# Altium schematic sheet STM32H755_Breakout_Schematic.SchDoc
size A; SheetNumber: 1; SheetTotal: 3
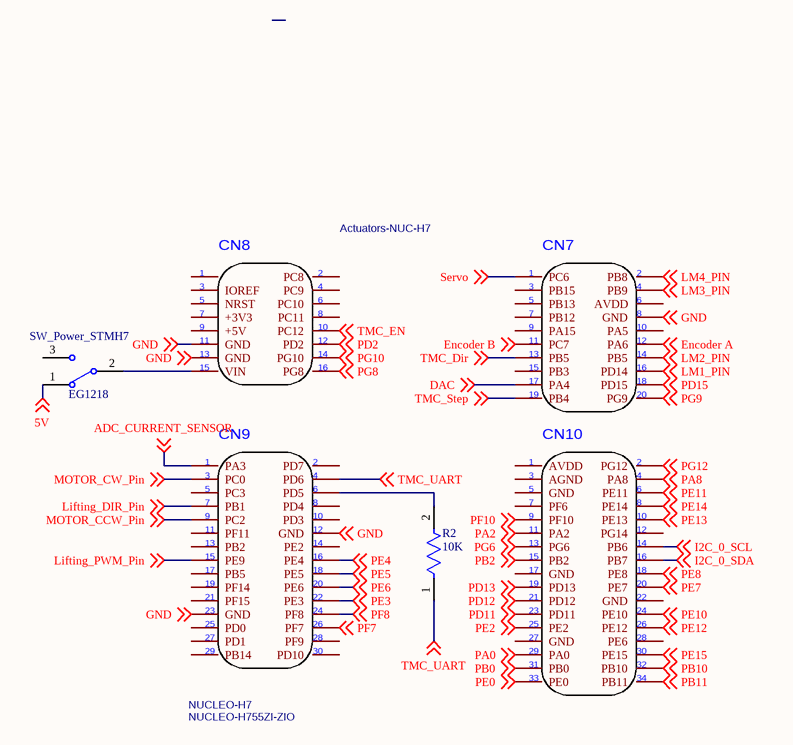
[diagram p0: STM32H755_Breakout_Schematic.SchDoc]

## Parts
Actuators-NUC-H7  NUCLEO-H755ZI-ZIO  [NUCLEO-H7]
R2  10K  [FP-MFR-12-MFG]
SW_Power_STMH7  EG1218  [ESWI-EG1218_V]

## Nets
5V: SW_Power_STMH7.1 ; off-sheet 5V
ADC_CURRENT_SENSOR: Actuators-NUC-H7.161(PA3) ; off-sheet ADC_CURRENT_SENSOR
DAC: Actuators-NUC-H7.207(PA4) ; off-sheet DAC
Encoder A: Actuators-NUC-H7.202(PA6) ; off-sheet Encoder A
Encoder B: Actuators-NUC-H7.201(PC7) ; off-sheet Encoder B
GND: Actuators-NUC-H7.155(GND) Actuators-NUC-H7.157(GND) Actuators-NUC-H7.172(GND) Actuators-NUC-H7.183(GND) Actuators-NUC-H7.198(GND) ; off-sheet GND
I2C_0_SCL: Actuators-NUC-H7.224(PB6) ; off-sheet I2C_0_SCL
I2C_0_SDA: Actuators-NUC-H7.226(PB7) ; off-sheet I2C_0_SDA
Lifting_DIR_Pin: Actuators-NUC-H7.167(PB1) ; off-sheet Lifting_DIR_Pin
Lifting_PWM_Pin: Actuators-NUC-H7.175(PE9) ; off-sheet Lifting_PWM_Pin
LM1_PIN: Actuators-NUC-H7.206(PD14) ; off-sheet LM1_PIN
LM2_PIN: Actuators-NUC-H7.204(PB5) ; off-sheet LM2_PIN
LM3_PIN: Actuators-NUC-H7.194(PB9) ; off-sheet LM3_PIN
LM4_PIN: Actuators-NUC-H7.192(PB8) ; off-sheet LM4_PIN
MOTOR_CCW_Pin: Actuators-NUC-H7.169(PC2) ; off-sheet MOTOR_CCW_Pin
MOTOR_CW_Pin: Actuators-NUC-H7.163(PC0) ; off-sheet MOTOR_CW_Pin
PA0: Actuators-NUC-H7.239(PA0) ; off-sheet PA0
PA2: Actuators-NUC-H7.221(PA2) ; off-sheet PA2
PA8: Actuators-NUC-H7.214(PA8) ; off-sheet PA8
PB0: Actuators-NUC-H7.241(PB0) ; off-sheet PB0
PB2: Actuators-NUC-H7.225(PB2) ; off-sheet PB2
PB10: Actuators-NUC-H7.242(PB10) ; off-sheet PB10
PB11: Actuators-NUC-H7.244(PB11) ; off-sheet PB11
PD2: Actuators-NUC-H7.156(PD2) ; off-sheet PD2
PD11: Actuators-NUC-H7.233(PD11) ; off-sheet PD11
PD12: Actuators-NUC-H7.231(PD12) ; off-sheet PD12
PD13: Actuators-NUC-H7.229(PD13) ; off-sheet PD13
PD15: Actuators-NUC-H7.208(PD15) ; off-sheet PD15
PE0: Actuators-NUC-H7.243(PE0) ; off-sheet PE0
PE2: Actuators-NUC-H7.235(PE2) ; off-sheet PE2
PE3: Actuators-NUC-H7.182(PE3) ; off-sheet PE3
PE4: Actuators-NUC-H7.176(PE4) ; off-sheet PE4
PE5: Actuators-NUC-H7.178(PE5) ; off-sheet PE5
PE6: Actuators-NUC-H7.180(PE6) ; off-sheet PE6
PE7: Actuators-NUC-H7.230(PE7) ; off-sheet PE7
PE8: Actuators-NUC-H7.228(PE8) ; off-sheet PE8
PE10: Actuators-NUC-H7.234(PE10) ; off-sheet PE10
PE11: Actuators-NUC-H7.216(PE11) ; off-sheet PE11
PE12: Actuators-NUC-H7.236(PE12) ; off-sheet PE12
PE13: Actuators-NUC-H7.220(PE13) ; off-sheet PE13
PE14: Actuators-NUC-H7.218(PE14) ; off-sheet PE14
PE15: Actuators-NUC-H7.240(PE15) ; off-sheet PE15
PF7: Actuators-NUC-H7.186(PF7) ; off-sheet PF7
PF8: Actuators-NUC-H7.184(PF8) ; off-sheet PF8
PF10: Actuators-NUC-H7.219(PF10) ; off-sheet PF10
PG6: Actuators-NUC-H7.223(PG6) ; off-sheet PG6
PG8: Actuators-NUC-H7.160(PG8) ; off-sheet PG8
PG9: Actuators-NUC-H7.210(PG9) ; off-sheet PG9
PG10: Actuators-NUC-H7.158(PG10) ; off-sheet PG10
PG12: Actuators-NUC-H7.212(PG12) ; off-sheet PG12
Servo: Actuators-NUC-H7.191(PC6) ; off-sheet Servo
TMC_Dir: Actuators-NUC-H7.203(PB5) ; off-sheet TMC_Dir
TMC_EN: Actuators-NUC-H7.154(PC12) ; off-sheet TMC_EN
TMC_Step: Actuators-NUC-H7.209(PB4) ; off-sheet TMC_Step
TMC_UART: Actuators-NUC-H7.164(PD6) R2.1 ; off-sheet TMC_UART
NetActuators-NUC-H7_159: Actuators-NUC-H7.159(VIN) SW_Power_STMH7.2(COM)
NetActuators-NUC-H7_166: Actuators-NUC-H7.166(PD5) R2.2

Not connected (* = marked no-connect by the designer): Actuators-NUC-H7 145(PC10) 146(PC8) 147(IOREF) 148(PC9) 149(NRST) 150(PC10) 151(+3V3) 152(PC11) 153(+5V) 162(PD7) 165(PC3) 168(PD4) 170(PD3) 171(PF11) 173(PB2) 174(PE2) 177(PB5) 179(PF14) 181(PF15) 185(PD0) 187(PD1) 188(PF9) 189(PB14) 190(PD10) 193(PB15) 195(PB13) 196(AVDD) 197(PB12) 199(PA15) 200(PA5) 205(PB3) 211(AVDD) 213(AGND) 215(GND) 217(PF6) 222(PG14) 227(GND) 232(GND) 237(GND) 238(PE6); SW_Power_STMH7 3

## Notes on the sheet
- (in symbol NUCLEO-H755ZI-ZIO) CN8; CN7; 1; 2; 3; 4; 5; 6; 7; 8; 9; 10; 11; 12; 13; 14; 15; 16; 17; 18; 19; 20; CN9; CN10; 21; 22; 23; 24; 25; 26; 27; 28; 29; 30; 31; 32; 33; 34; NUCLEO-H7

## Library data of the parts
Actuators-NUC-H7 = NUCLEO-H755ZI-ZIO: Contributor: zutawin; Package Display: Yes; spicePre: X; Mounted: Yes; Supplier Part: 100x; Supplier: DOLI; spiceSymbolName: NUCLEO-H755ZI-ZIO
R2 = CMP-03413-000012-1: RES MF 1/6W 1% AXIAL; Power Rating: 160mW; Voltage Rating (DC): 200V; Resistance: 10kR; Min Operating Temperature: -55°C; Max Operating Temperature: 155°C; Voltage Rating: 200V; Termination: Axial; Packaging: Ammo Pack; Tolerance: 1%
SW_Power_STMH7 = CMP-1696-00002-1: Slide Switch, 500 V, -20 to 70 degC, 3-Pin THD, RoHS; Case\Package: SOT-23-5; Output Current: 150 mA; Nominal Output Voltage: 3.3 V; Max Power Dissipation: 250 mW; Min Input Voltage: 4.3 V; Outputs: 1; Max Input Voltage: 8 V; Dropout Voltage: 300 mV; PackageDescription: 3-Pin Through Hole Device, Body 11.6 x 4 mm, Pitch 2.5 mm; ComponentLink1URL: http://www.e-switch.ch/en/; RoHSCompliant: true; Length: 3 mm; ComponentLink1Description: Manufacturer URL; Power Rating: 250 mW; Mount: Surface Mount; Max Operating Temperature: 85 degC; REACH SVHC: No SVHC; Radiation Hardening: No; Height: 1.3 mm; Pins: 5; Max Ouput Current: 150 mA; Output Voltage: 3.3 V; Width: 1.8 mm; Package Quantity: 3000; ComponentLink2URL: https://www.e-switch.com/system/asset/product_line/data_sheet/119/EG.pdf; Min Operating Temperature: -40 degC; ComponentLink2Description: Datasheet; DatasheetVersion: Oct-15; PackageReference: EG1218; Packaging: Tape and Reel